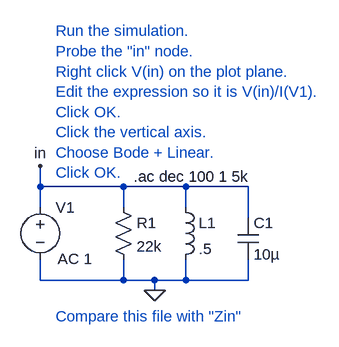
[diagram p0: schematic Zin2.asc]
Zin2.asc, the LTspice schematic file:
Version 4
SHEET 1 880 680
WIRE 32 176 32 144
WIRE 160 176 32 176
WIRE 256 176 160 176
WIRE 352 176 256 176
WIRE 32 208 32 176
WIRE 160 208 160 176
WIRE 256 208 256 176
WIRE 352 224 352 176
WIRE 32 320 32 288
WIRE 160 320 160 288
WIRE 160 320 32 320
WIRE 208 320 160 320
WIRE 256 320 256 288
WIRE 256 320 208 320
WIRE 352 320 352 288
WIRE 352 320 256 320
WIRE 208 336 208 320
FLAG 208 336 0
FLAG 32 144 in
SYMBOL ind 240 192 R0
SYMATTR InstName L1
SYMATTR Value .5
SYMBOL cap 336 224 R0
SYMATTR InstName C1
SYMATTR Value 10µ
SYMBOL res 144 192 R0
SYMATTR InstName R1
SYMATTR Value 22k
SYMBOL voltage 32 192 R0
WINDOW 123 27 95 Left 0
WINDOW 39 0 0 Left 0
SYMATTR Value2 AC 1
SYMATTR InstName V1
SYMATTR Value ""
TEXT 176 160 Left 0 !.ac dec 100 1 5k
TEXT 56 -64 Left 0 ;Run the simulation.\nProbe the "in" node.\nRight click V(in) on the plot plane.\nEdit the expression so it is V(in)/I(V1).\nClick OK.\nClick the vertical axis.\nChoose Bode + Linear.\nClick OK.
TEXT 56 376 Left 0 ;Compare this file with "Zin"

The netlist it stands for:
* Zin2.asc
L1 in 0 .5
C1 in 0 10µ
R1 in 0 22k
V1 in 0 AC 1
.ac dec 100 1 5k
* Run the simulation.
* Probe the "in" node.
* Right click V(in) on the plot plane.
* Edit the expression so it is V(in)/I(V1).
* Click OK.
* Click the vertical axis.
* Choose Bode + Linear.
* Click OK.
* Compare this file with "Zin"
.backanno
.end